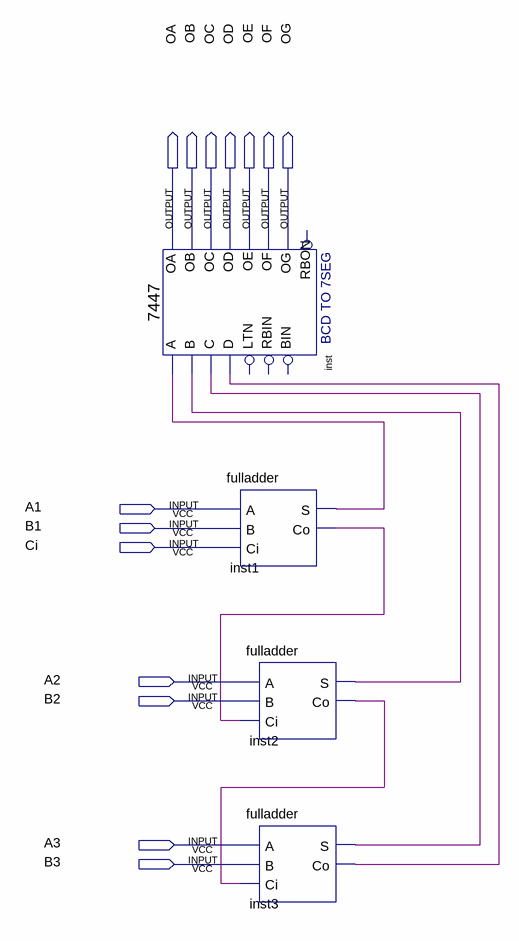
[diagram p0: schematic sheet]
// Quartus schematic Block1.bdf as structural Verilog: 4 symbols, 14 pins
module Block1 (
  input  A1,
  input  B1,
  input  Ci,
  input  A2,
  input  B2,
  input  A3,
  input  B3,
  output OA,
  output OB,
  output OC,
  output OD,
  output OE,
  output OF,
  output OG
);

  wire inst1_co, inst1_s, inst2_co, inst2_s, inst3_co, inst3_s;

  \7447  inst (
    .B(inst2_s), .C(inst3_s), .D(inst3_co), .A(inst1_s), .OB(OB), .OC(OC), .OE(OE), .OD(OD), .OF(OF),
    .OG(OG), .OA(OA));  // open: LTN, RBIN, BIN, RBON
  fulladder inst1 (.A(A1), .B(B1), .Ci(Ci), .S(inst1_s), .Co(inst1_co));
  fulladder inst2 (.A(A2), .B(B2), .Ci(inst1_co), .S(inst2_s), .Co(inst2_co));
  fulladder inst3 (.A(A3), .B(B3), .Ci(inst2_co), .S(inst3_s), .Co(inst3_co));
endmodule
